# EAGLE design vapeduino_v0001 (EAGLE 7.2.0)

## Sheet 1 of 8: Board Outline
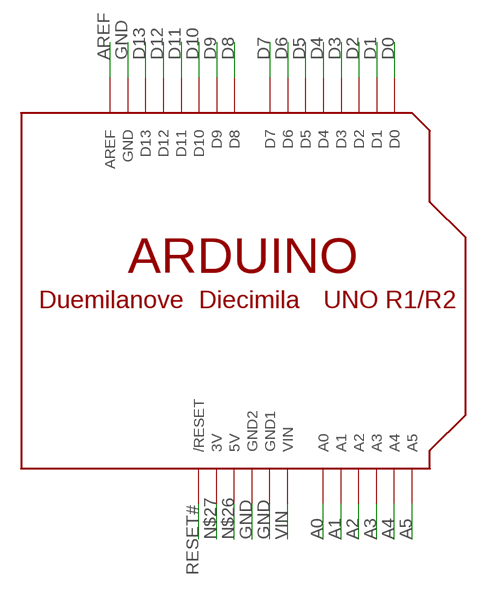
[diagram p0: schematic, sheet 1]

### Parts
U$1  ARDUINOUNO  [ARDUINO]

### Nets
A0: U$1.A0
A1: U$1.A1
A2: U$1.A2
A3: U$1.A3
A4: U$1.A4
A5: U$1.A5
AREF: U$1.AREF
D0: U$1.D0
D1: U$1.D1
D2: U$1.D2
D3: U$1.D3
D4: U$1.D4
D5: U$1.D5
D6: U$1.D6
D7: U$1.D7
D8: U$1.D8
D9: U$1.D9
D10: U$1.D10
D11: U$1.D11
D12: U$1.D12
D13: U$1.D13
GND: U$1.GND U$1.GND1 U$1.GND2 ; also sheet 5,6
N$26: U$1.5V
N$27: U$1.3V
RESET#: U$1.RESET(/RESET)
VIN: U$1.VIN

## Sheet 2 of 8: PSU - 5V

## Sheet 3 of 8: PSU - 3V3

## Sheet 4 of 8: PSU - 16V Gate Driver

## Sheet 5 of 8: USB Programmer
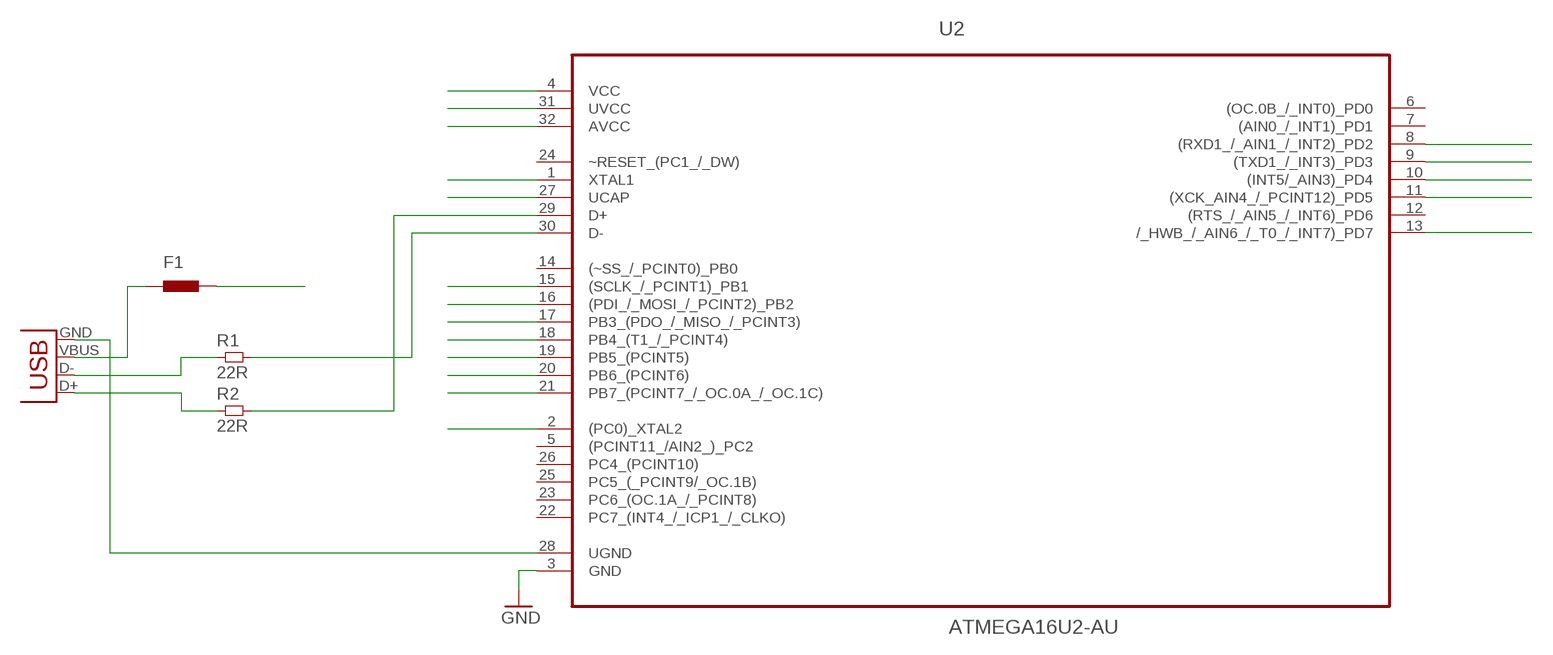
[diagram p1: schematic, sheet 5]

### Parts
F1  RES_FUSE  [1812]
JP2  USB-B  USBPTH  [USB-B-PTH]
R1  22R  RES0603L3  [0603L3]
R2  22R  RES0603L3  [0603L3]
U2  ATMEGA16U2-AU  [QFP80P900X900X120-32N]

### Nets
GND: U2.3(GND) ; also sheet 1,6
N$1: JP2.D- R1.P$1
N$2: JP2.D+ R2.P$1
N$3: R2.P$2 U2.29(D+)
N$4: R1.P$2 U2.30(D-)
N$5: JP2.GND U2.28(UGND)
N$6: F1.1 JP2.VBUS
N$7: U2.8((RXD1_/_AIN1_/_INT2)_PD2)
N$8: U2.9((TXD1_/_INT3)_PD3)
N$9: U2.10((INT5/_AIN3)_PD4)
N$10: U2.11((XCK_AIN4_/_PCINT12)_PD5)
N$11: U2.15((SCLK_/_PCINT1)_PB1)
N$12: U2.16((PDI_/_MOSI_/_PCINT2)_PB2)
N$13: U2.17(PB3_(PDO_/_MISO_/_PCINT3))
N$14: U2.18(PB4_(T1_/_PCINT4))
N$15: U2.19(PB5_(PCINT5))
N$16: U2.20(PB6_(PCINT6))
N$17: U2.21(PB7_(PCINT7_/_OC.0A_/_OC.1C))
N$18: U2.13(/_HWB_/_AIN6_/_T0_/_INT7)_PD7)
N$19: U2.27(UCAP)
N$20: U2.31(UVCC)
N$21: U2.4(VCC)
N$22: U2.32(AVCC)
N$23: U2.1(XTAL1)
N$24: U2.2((PC0)_XTAL2)
N$25: F1.2
Unconnected: U2.5((PCINT11_/AIN2_)_PC2) U2.6((OC.0B_/_INT0)_PD0) U2.7((AIN0_/_INT1)_PD1) U2.12((RTS_/_AIN5_/_INT6)_PD6) U2.14((~SS_/_PCINT0)_PB0) U2.22(PC7_(INT4_/_ICP1_/_CLKO)) U2.23(PC6_(OC.1A_/_PCINT8)) U2.24(~RESET_(PC1_/_DW)) U2.25(PC5_(_PCINT9/_OC.1B)) U2.26(PC4_(PCINT10))

## Sheet 6 of 8: MCU
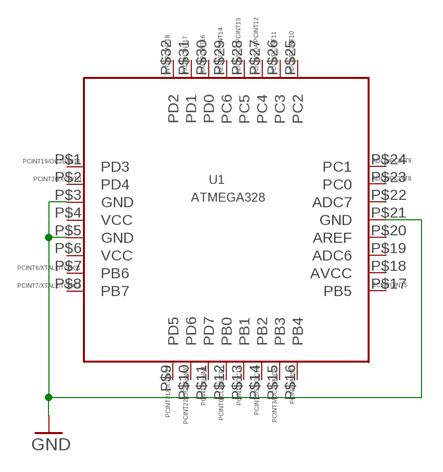
[diagram p2: schematic, sheet 6]

### Parts
U1  ATMEGA328  [QFN32]

### Nets
GND: U1.P$3(GND) U1.P$5(GND) U1.P$21(GND) ; also sheet 1,5
Unconnected: U1.P$1(PD3) U1.P$2(PD4) U1.P$4(VCC) U1.P$6(VCC) U1.P$7(PB6) U1.P$8(PB7) U1.P$9(PD5) U1.P$10(PD6) U1.P$11(PD7) U1.P$12(PB0) U1.P$13(PB1) U1.P$14(PB2) U1.P$15(PB3) U1.P$16(PB4) U1.P$17(PB5) U1.P$18(AVCC) U1.P$19(ADC6) U1.P$20(AREF) U1.P$22(ADC7) U1.P$23(PC0) U1.P$24(PC1) U1.P$25(PC2) U1.P$26(PC3) U1.P$27(PC4) U1.P$28(PC5) U1.P$29(PC6) U1.P$30(PD0) U1.P$31(PD1) U1.P$32(PD2)

## Sheet 7 of 8: Gate Driver

## Sheet 8 of 8: Battery Monitor

## Library data of the parts
F1 = common:RES_FUSE
JP2 = SparkFun-Connectors:USB: USB Connectors USB-B-PTH is fully proven SKU : PRT-00139/CONN-08278 USB-miniB is fully proven SKU : PRT-00587 USB-A-PCB is untested. USB-A-H is throughly reviewed, but untested. Spark Fun Electronics SKU : PRT-00437 USB-B-SMT is throughly reviewed, but untested. Needs silkscreen touching up. USB-A-S has not been used/tested USB-MB-H has not been used/tested USB-MICROB has been used. CONN-09505; PROD_ID: CONN-08278
R1 R2 = common:RES
U1 = common:ATMEGA328
U2 = Atmel_By_element14_Batch_1:ATMEGA16U2-AU: 8-bit Microcontroller; MPN: ATMEGA16U2-AU; OC_FARNELL: 1841607; OC_NEWARK: 12T1292; PACKAGE: QFP-32; SUPPLIER: Atmel
U$1 = adafruit:ARDUINO: Arduino Diecimila/Duemilanove Make a shield with ease, this package has all the named pins as well as the two mounting drill holes and an outline of the USB and DC power connector. The outline is on the DIMENSION layer, so if your board house uses it they will cut the outline to match. http://www.ladyada.net/library/pcb/eaglelibrary.html

## Board
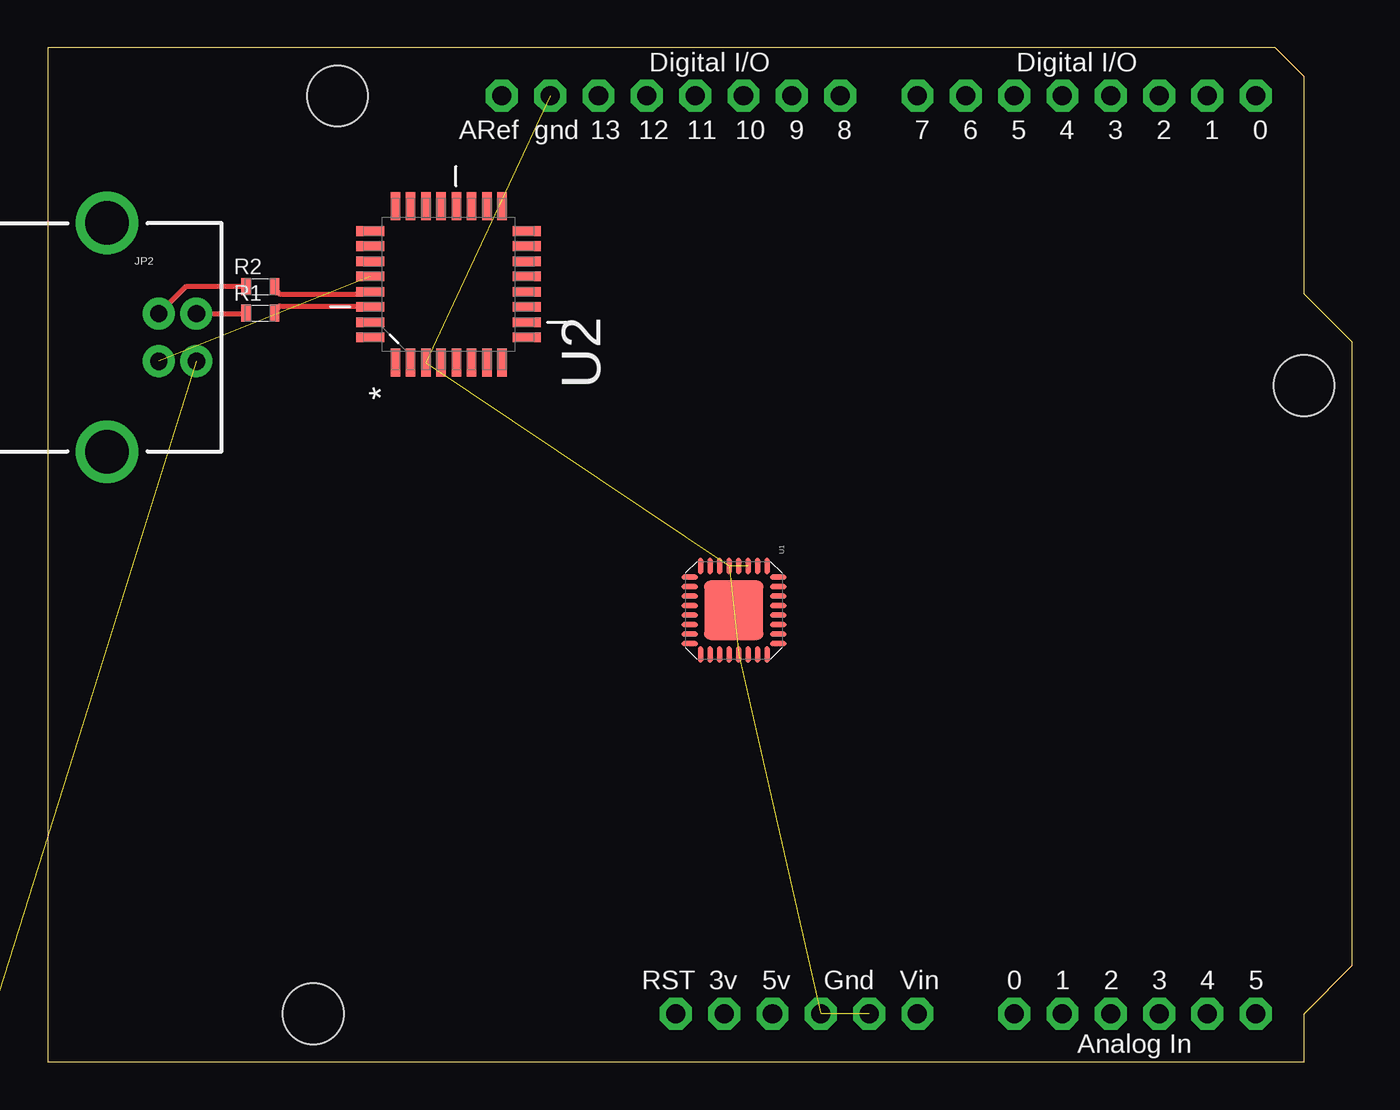
[diagram p3: board, top side]

Size 68.58 x 53.34 mm. Coordinates in mm from the lower left corner, seen from the top.
Copper layers (1*16): Top 0.035mm / dielectric 1.5mm / Bottom 0.035mm
Design rules "default": minimum track width 10mil, minimum drill 24mil, track to track 8mil, track to pad 8mil, pad to pad 8mil, via to via 8mil, smd to smd 8mil, copper to edge 40mil, drill to drill 8mil, minimum pad ring 10mil, minimum via ring 8mil, stop-mask expansion 4mil, vias tented up to drill 0mil, thermal gap 10mil

### Footprints (pad centres in the part's own frame; a part is rotated, then mirrored left to right if it is on the bottom)
1812 = smd 1.5 x 3.2: 1 -2.1,0; 2 2.1,0
USB-B-PTH = drill 0.914 pad 1.676: D+ 0,1.25; D- 1.981,1.25; GND 0,-1.25; VBUS 1.981,-1.25 | drill 2.286: S1 -2.718,-6.02; S2 -2.718,6.02
0603L3 = smd 0.5 x 0.9: P$1 -0.75,0; P$2 0.75,0
QFN32 = smd 0.85 x 0.25: P$1 -2.325,1.75; P$2 -2.325,1.25; P$3 -2.325,0.75; P$4 -2.325,0.25; P$5 -2.325,-0.25; P$6 -2.325,-0.75; P$7 -2.325,-1.25; P$8 -2.325,-1.75; P$17 2.325,-1.75; P$18 2.325,-1.25; P$19 2.325,-0.75; P$20 2.325,-0.25; P$21 2.325,0.25; P$22 2.325,0.75; P$23 2.325,1.25; P$24 2.325,1.75 | smd 0.25 x 0.85: P$9 -1.75,-2.325; P$10 -1.25,-2.325; P$11 -0.75,-2.325; P$12 -0.25,-2.325; P$13 0.25,-2.325; P$14 0.75,-2.325; P$15 1.25,-2.325; P$16 1.75,-2.325; P$25 1.75,2.325; P$26 1.25,2.325; P$27 0.75,2.325; P$28 0.25,2.325; P$29 -0.25,2.325; P$30 -0.75,2.325; P$31 -1.25,2.325; P$32 -1.75,2.325 | smd 3.1 x 3.1: P$33 0,0
QFP80P900X900X120-32N = smd 1.473 x 0.508: 1 -4.115,2.794; 2 -4.115,2.007; 3 -4.115,1.194; 4 -4.115,0.406; 5 -4.115,-0.406; 6 -4.115,-1.194; 7 -4.115,-2.007; 8 -4.115,-2.794; 17 4.115,-2.794; 18 4.115,-2.007; 19 4.115,-1.194; 20 4.115,-0.406; 21 4.115,0.406; 22 4.115,1.194; 23 4.115,2.007; 24 4.115,2.794 | smd 0.508 x 1.473: 9 -2.794,-4.115; 10 -2.007,-4.115; 11 -1.194,-4.115; 12 -0.406,-4.115; 13 0.406,-4.115; 14 1.194,-4.115; 15 2.007,-4.115; 16 2.794,-4.115; 25 2.794,4.115; 26 2.007,4.115; 27 1.194,4.115; 28 0.406,4.115; 29 -0.406,4.115; 30 -1.194,4.115; 31 -2.007,4.115; 32 -2.794,4.115
ARDUINO = drill 1 pad 1.676 octagon: 3V 35.56,2.54; 5V 38.1,2.54; A0 50.8,2.54; A1 53.34,2.54; A2 55.88,2.54; A3 58.42,2.54; A4 60.96,2.54; A5 63.5,2.54; AREF 23.876,50.8; D0 63.5,50.8; D1 60.96,50.8; D2 58.42,50.8; D3 55.88,50.8; D4 53.34,50.8; D5 50.8,50.8; D6 48.26,50.8; D7 45.72,50.8; D8 41.656,50.8; D9 39.116,50.8; D10 36.576,50.8; D11 34.036,50.8; D12 31.496,50.8; D13 28.956,50.8; GND 26.416,50.8; GND1 43.18,2.54; GND2 40.64,2.54; RESET 33.02,2.54; VIN 45.72,2.54 | hole 3.2: 15.24,50.8; 66.04,35.56; 13.97,2.54

### Placement (x,y rotation side)
F1  -3.18,-4.95 0 top  (outside the outline)
JP2  5.84,38.1 0 top
R1  11.18,39.37 0 top
R2  11.18,40.77 0 top
U1  36.07,23.75 270 top
U2  21.08,40.89 90 top
U$1  0,0 0 top

### Tracks (layer width: path | path; a pad name or v marks a point on that pad's centre or on a via)
GND  (6 unrouted)
N$1
  Top 0.254: JP2.D- 10.41,39.35 R1.P$1
N$2
  Top 0.254: R2.P$1 7.26,40.77 JP2.D+
N$3
  Top 0.254: R2.P$2 11.93,40.65 12.19,40.39 16.26,40.39 16.36,40.49 U2.29
N$4
  Top 0.254: R1.P$2 11.93,39.49 12.19,39.75 16.38,39.75 16.43,39.7 U2.30
N$5  (1 unrouted)
N$6  (1 unrouted)